# Altium schematic sheet bridge.SchDoc
size A4
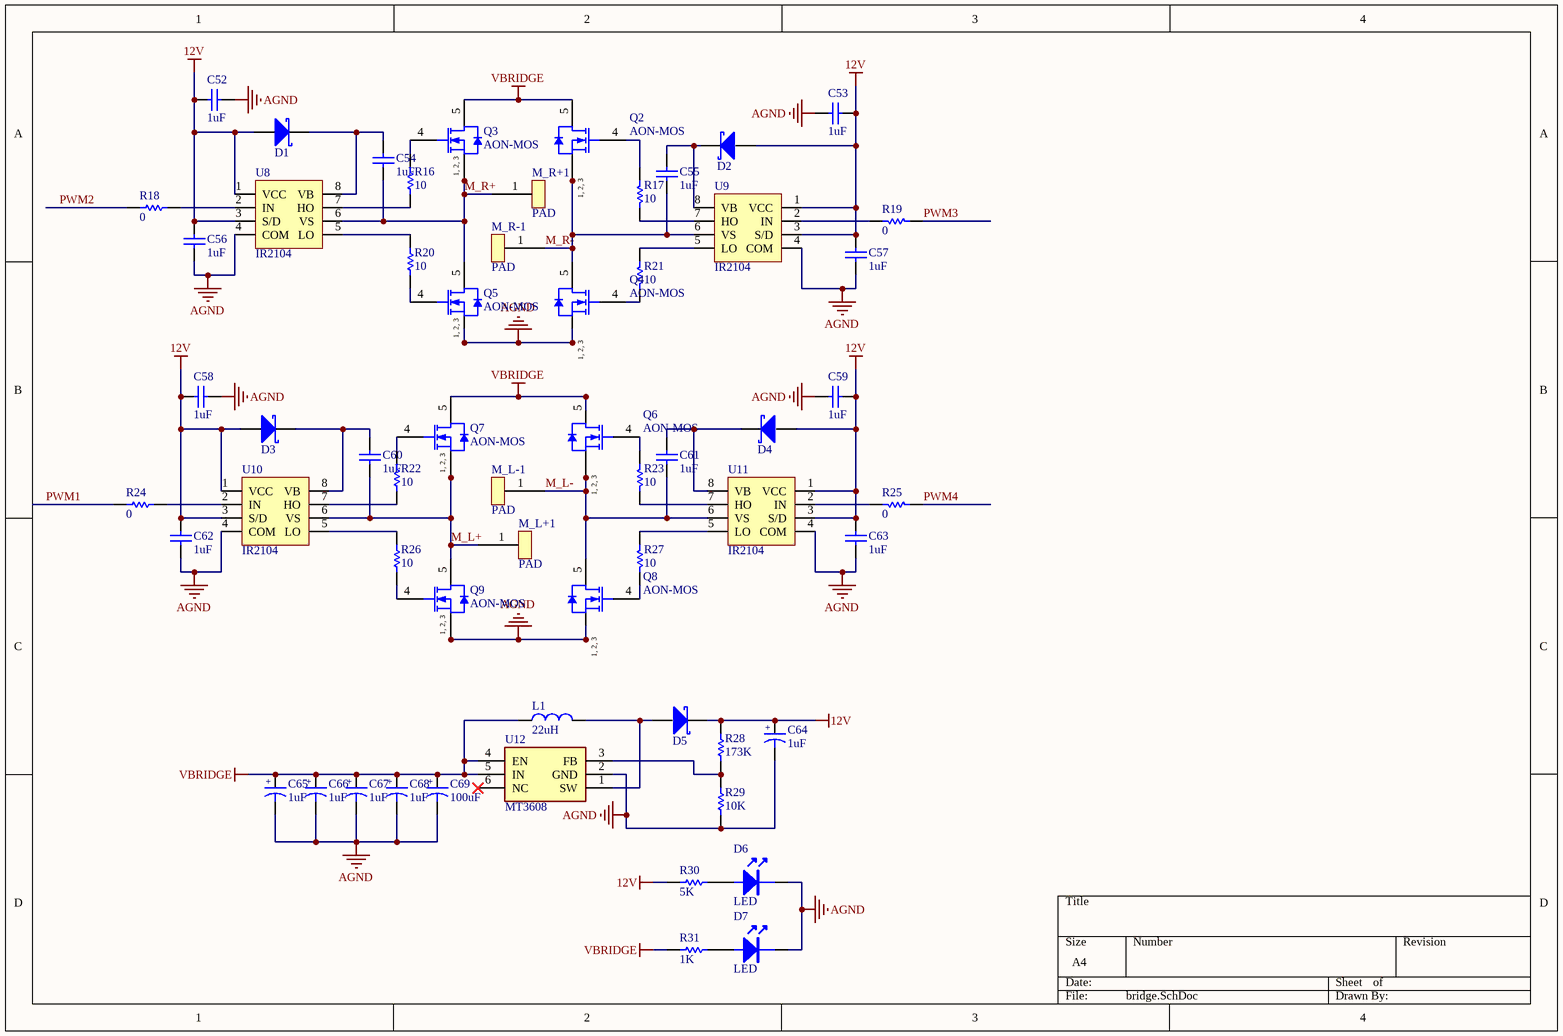
[diagram p0: bridge.SchDoc]

## Parts
C52  1uF  [C1210]
C53  1uF  [C1210]
C54  1uF  [0603_C]
C55  1uF  [0603_C]
C56  1uF  [0603_C]
C57  1uF  [0603_C]
C58  1uF  [C1210]
C59  1uF  [C1210]
C60  1uF  [0603_C]
C61  1uF  [0603_C]
C62  1uF  [0603_C]
C63  1uF  [0603_C]
C64  1uF  [C6.3X6.3]
C65  1uF  [C6.3X6.3]
C66  1uF  [C6.3X6.3]
C67  1uF  [C6.3X6.3]
C68  1uF  [C6.3X6.3]
C69  100uF  [C6.3X6.3]
D1  Diode Schottky  [DO-214AC]  (value not drawn)
D2  Diode Schottky  [DO-214AC]  (value not drawn)
D3  Diode Schottky  [DO-214AC]  (value not drawn)
D4  Diode Schottky  [DO-214AC]  (value not drawn)
D5  Diode Schottky  [DO-214AC]  (value not drawn)
D6  LED  [0603_LED]
D7  LED  [0603_LED]
L1  22uH  [L 5x5]
M_L+1  PAD  [PAD_BIG]
M_L-1  PAD  [PAD_BIG]
M_R+1  PAD  [PAD_BIG]
M_R-1  PAD  [PAD_BIG]
Q2  AON-MOS  [so-8]
Q3  AON-MOS  [so-8]
Q4  AON-MOS  [so-8]
Q5  AON-MOS  [so-8]
Q6  AON-MOS  [so-8]
Q7  AON-MOS  [so-8]
Q8  AON-MOS  [so-8]
Q9  AON-MOS  [so-8]
R16  10  [0603_R]
R17  10  [0603_R]
R18  0  [0603_R]
R19  0  [0603_R]
R20  10  [0603_R]
R21  10  [0603_R]
R22  10  [0603_R]
R23  10  [0603_R]
R24  0  [0603_R]
R25  0  [0603_R]
R26  10  [0603_R]
R27  10  [0603_R]
R28  173K  [0603_R]
R29  10K  [0603_R]
R30  5K  [0603_R]
R31  1K  [0603_R]
U8  IR2104  [SOIC-8]
U9  IR2104  [SOIC-8]
U10  IR2104  [SOIC-8]
U11  IR2104  [SOIC-8]
U12  MT3608  [SOT95P280X145-6N]

## Nets
12V: C52.1 C53.2 C56.2 C57.2 C58.1 C59.2 C62.2 C63.2 C64.1 D1.1(A) D2.1(A) D3.1(A) D4.1(A) D5.2(K) R28.2 R30.2 U8.1(VCC) U8.3(S/D) U9.1(VCC) U9.3(S/D) U10.1(VCC) U10.3(S/D) U11.1(VCC) U11.3(S/D)
AGND: C52.2 C53.1 C56.1 C57.1 C58.2 C59.1 C62.1 C63.1 C64.2 C65.2 C66.2 C67.2 C68.2 C69.2 D6.2(K) D7.2(K) Q4.1(S) Q4.2(S) Q4.3(S) Q5.1(S) Q5.2(S) Q5.3(S) Q8.1(S) Q8.2(S) Q8.3(S) Q9.1(S) Q9.2(S) Q9.3(S) R29.1 U8.4(COM) U9.4(COM) U10.4(COM) U11.4(COM) U12.2(GND)
VBRIDGE: C65.1 C66.1 C67.1 C68.1 C69.1 L1.1 Q2.5(D) Q3.5(D) Q6.5(D) Q7.5(D) R31.2 U12.4(EN) U12.5(IN)
M_L+: C60.1 M_L+1.1 Q7.1(S) Q7.2(S) Q7.3(S) Q9.5(D) U10.6(VS)
M_L-: C61.1 M_L-1.1 Q6.1(S) Q6.2(S) Q6.3(S) Q8.5(D) U11.6(VS)
M_R+: C54.1 M_R+1.1 Q3.1(S) Q3.2(S) Q3.3(S) Q5.5(D) U8.6(VS)
M_R-: C55.1 M_R-1.1 Q2.1(S) Q2.2(S) Q2.3(S) Q4.5(D) U9.6(VS)
PWM1: R24.1
PWM2: R18.1
PWM3: R19.1
PWM4: R25.1
NetC54_2: C54.2 D1.2(K) U8.8(VB)
NetC55_2: C55.2 D2.2(K) U9.8(VB)
NetC60_2: C60.2 D3.2(K) U10.8(VB)
NetC61_2: C61.2 D4.2(K) U11.8(VB)
NetD5_1: D5.1(A) L1.2 U12.1(SW)
NetD6_1: D6.1(A) R30.1
NetD7_1: D7.1(A) R31.1
NetQ2_4: Q2.4(G) R17.2
NetQ3_4: Q3.4(G) R16.2
NetQ4_4: Q4.4(G) R21.2
NetQ5_4: Q5.4(G) R20.2
NetQ6_4: Q6.4(G) R23.2
NetQ7_4: Q7.4(G) R22.2
NetQ8_4: Q8.4(G) R27.2
NetQ9_4: Q9.4(G) R26.2
NetR16_1: R16.1 U8.7(HO)
NetR17_1: R17.1 U9.7(HO)
NetR18_2: R18.2 U8.2(IN)
NetR19_2: R19.2 U9.2(IN)
NetR20_1: R20.1 U8.5(LO)
NetR21_1: R21.1 U9.5(LO)
NetR22_1: R22.1 U10.7(HO)
NetR23_1: R23.1 U11.7(HO)
NetR24_2: R24.2 U10.2(IN)
NetR25_2: R25.2 U11.2(IN)
NetR26_1: R26.1 U10.5(LO)
NetR27_1: R27.1 U11.5(LO)
NetR28_1: R28.1 R29.2 U12.3(FB)

Not connected (* = marked no-connect by the designer): U12 6(NC)*

## Notes on the sheet
- (in symbol CAP1) +
- (in symbol Cap_polar) +
- (in symbol N-MOS-so) 1, 2, 3

## Library data of the parts
C52-C63 = CAP: Capacitor; Value: 104; Published: 8-Jun-2000; LatestRevisionDate: 17-Jul-2002; LatestRevisionNote: Re-released for DXP Platform.; PackageReference: RAD-0.3; Publisher: Altium Limited
C64-C68 = CAP1
C69 = Cap_polar
D6 D7 = LED: LED 发光二极管
L1 = L_Inductance
Q2-Q9 = N-MOS-so
R16-R30 = RES: Resistor; Value: 1K; Published: 8-Jun-2000; Revision: July-2002: Re-released for DXP Platform.; Publisher: Altium Limited
R31 = RES: Resistor; Published: 8-Jun-2000; Revision: July-2002: Re-released for DXP Platform.; Publisher: Altium Limited; Value: 1K
U8-U11 = IR2104: 半桥驱动器
U12 = MT3608: Undefined or Miscellaneous; Manufacturer_Name: Aerosemi; Datasheet Link: https://www.olimex.com/Products/Breadboarding/BB-PWR-3608/resources/MT3608.pdf; Height: 1.45mm; Manufacturer_Part_Number: MT3608